# Altium schematic sheet RPi_DAQ_Hat_MCU.SchDoc
size A
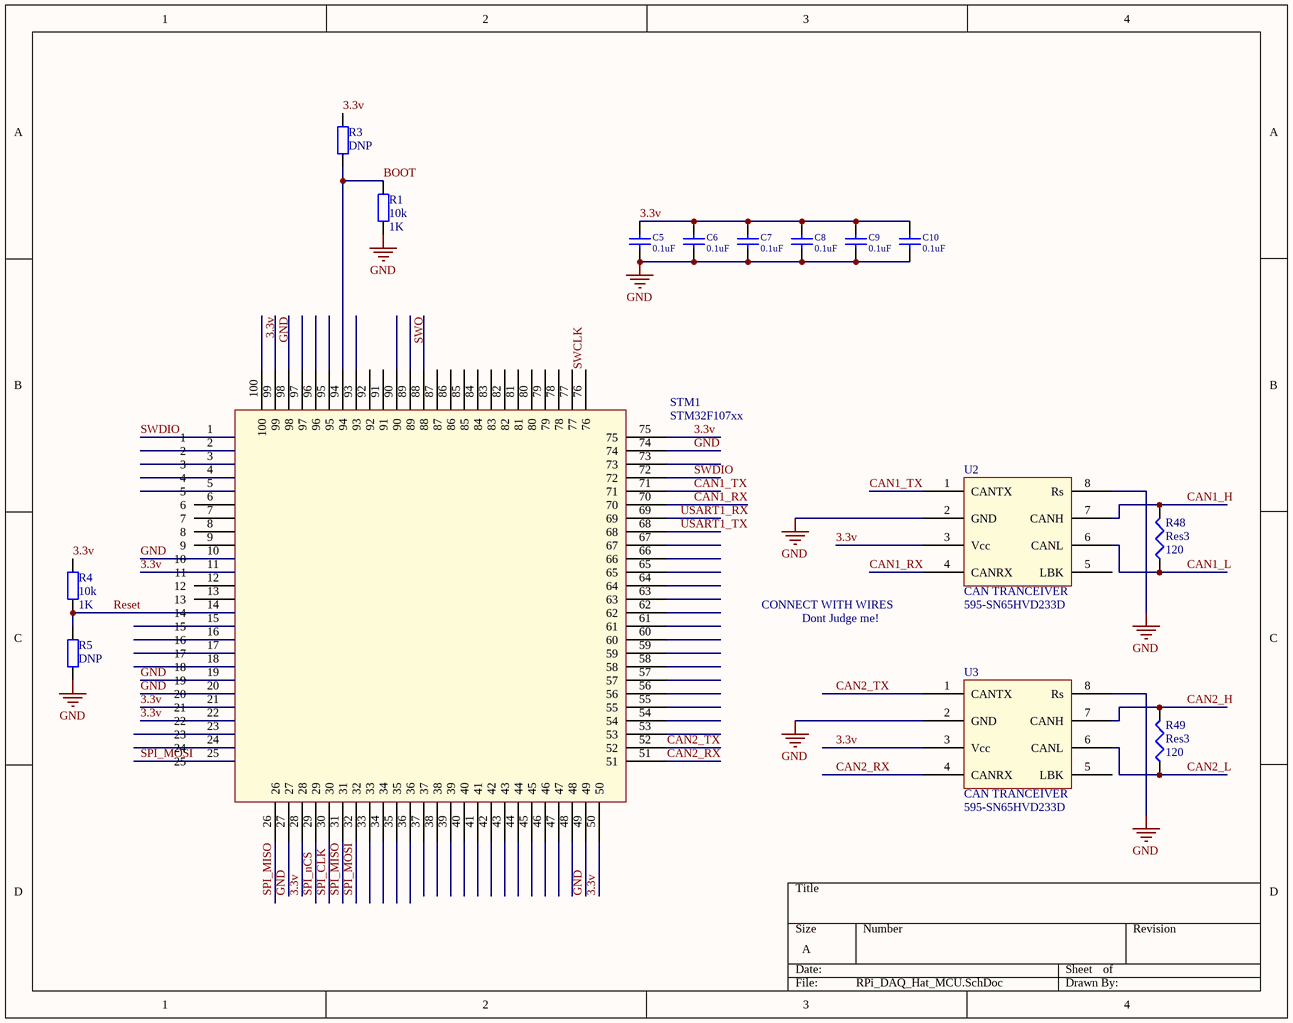
[diagram p0: RPi_DAQ_Hat_MCU.SchDoc]

## Parts
C5  0.1uF  [R0805]
C6  0.1uF  [R0805]
C7  0.1uF  [R0805]
C8  0.1uF  [R0805]
C9  0.1uF  [R0805]
C10  0.1uF  [R0805]
R1  10k  value 1K  [R0805]
R3  DNP  [R0805]
R4  10k  value 1K  [R0805]
R5  DNP  [R0805]
R48  Res3  value 120  [R0805]
R49  Res3  value 120  [R0805]
STM1  STM32F107xx  [LQFP100]
U2  CAN TRANCEIVER  Supplier Part Number 1: 595-SN65HVD233D  [SOP8]
U3  CAN TRANCEIVER  Supplier Part Number 1: 595-SN65HVD233D  [SOP8]

## Nets
GND: C5.2 C6.2 C7.2 C8.2 C9.2 C10.2 R1.1 R5.1 STM1.10 STM1.19 STM1.20 STM1.27 STM1.49 STM1.74 STM1.99 U2.2(GND) U2.8(Rs) U3.2(GND) U3.8(Rs)
3.3v: C5.1 C6.1 C7.1 C8.1 C9.1 C10.1 R3.2 R4.2 STM1.11 STM1.21 STM1.22 STM1.28 STM1.50 STM1.75 STM1.100 U2.3(Vcc) U3.3(Vcc)
BOOT: R1.2 R3.1 STM1.94
CAN1_H: R48.2 U2.7(CANH)
CAN1_L: R48.1 U2.6(CANL)
CAN1_RX: STM1.70 U2.4(CANRX)
CAN1_TX: STM1.71 U2.1(CANTX)
CAN2_H: R49.2 U3.7(CANH)
CAN2_L: R49.1 U3.6(CANL)
CAN2_RX: STM1.51 U3.4(CANRX)
CAN2_TX: STM1.52 U3.1(CANTX)
Reset: R4.1 R5.2 STM1.14
SPI_CLK: STM1.30
SPI_MISO: STM1.26 STM1.31
SPI_MOSI: STM1.25 STM1.32
SPI_nCS: STM1.29
SWCLK: STM1.76
SWDIO: STM1.1 STM1.72
SWO: STM1.89
USART1_RX: STM1.69
USART1_TX: STM1.68

Not connected (* = marked no-connect by the designer): STM1 2 3 4 5 6 7 8 9 12 13 15 16 17 18 23 24 33 34 35 36 37 38 39 40 41 42 43 44 45 46 47 48 53 54 55 56 57 58 59 60 61 62 63 64 65 66 67 73 77 78 79 80 81 82 83 84 85 86 87 88 90 91 92 93 95 96 97 98; U2 5(LBK); U3 5(LBK)

## Notes on the sheet
- CONNECT WITH WIRES
- Dont Judge me!

## Library data of the parts
C5-C10 = CAP_1: Capacitor; Supplier: FARNELL; Supplier Code: 317-287
R1 R4 = Res2: Resistor; Published: 8-Jun-2000; LatestRevisionDate: 17-Jul-2002; LatestRevisionNote: Re-released for DXP Platform.; PackageReference: AXIAL-0.4; Publisher: Altium Limited; PackageDescription: Axial Device, Thru-Hole; 2 Leads; 0.4 in Pin Spacing
R3 R5 = Res2: Resistor; Value: 1K; Published: 8-Jun-2000; LatestRevisionDate: 17-Jul-2002; LatestRevisionNote: Re-released for DXP Platform.; PackageReference: AXIAL-0.4; Publisher: Altium Limited; PackageDescription: Axial Device, Thru-Hole; 2 Leads; 0.4 in Pin Spacing
R48 R49 = Res3: Resistor; Published: 8-Jun-2000; LatestRevisionDate: 29-May-2009; LatestRevisionNote: IPC-7351 Footprint Added.; PackageReference: J1-0603; Publisher: Altium Limited; PackageDescription: Chip Resistor
U2 U3 = 595-SN65HVD233: Supplier 1: Mouser